# Altium schematic sheet Power.SchDoc
size A4; SheetNumber: 7; SheetTotal: 7
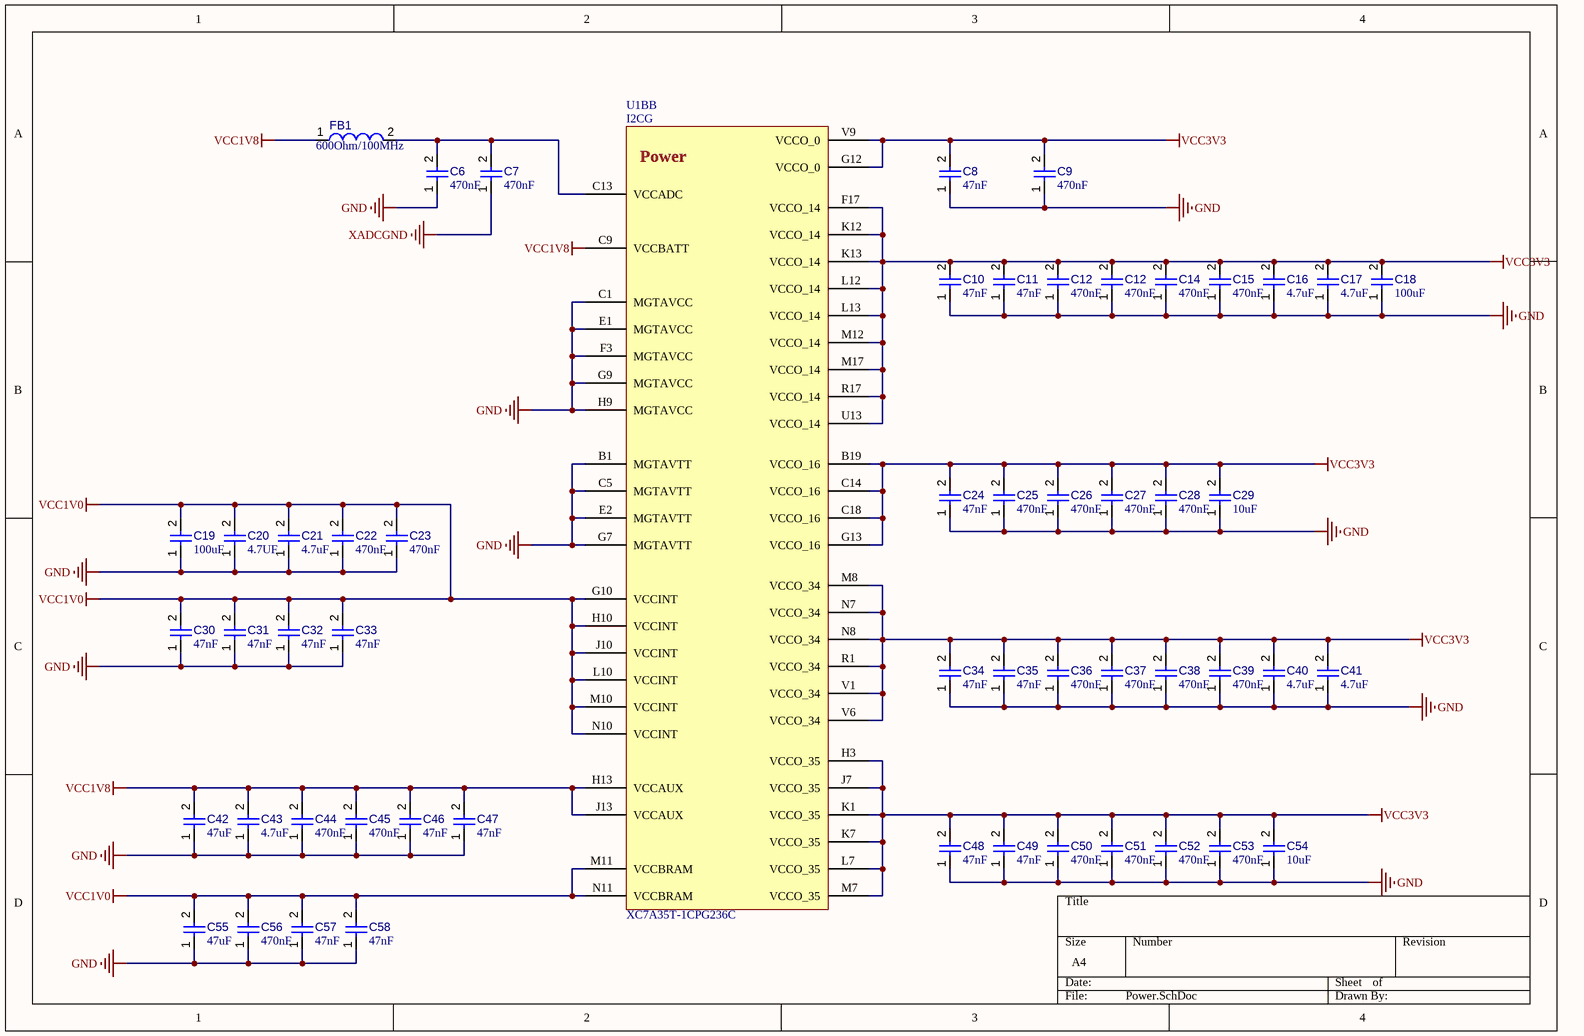
[diagram p0: Power.SchDoc]

## Parts
(Parts that share a designator on the sheet are numbered #1, #2 ... from top to bottom, then left to right.)
C6  value 470nF  [CAPC0603(1608)100_L]  (hidden comment: Capacitor 470nF +/-20% 25V 0603)
C7  value 470nF  [CAPC0603(1608)100_L]  (hidden comment: Capacitor 470nF +/-20% 25V 0603)
C8  value 47nF  [CAPC0603(1608)100_L]  (hidden comment: Capacitor 470nF +/-20% 25V 0603)
C9  value 470nF  [CAPC0603(1608)100_L]  (hidden comment: Capacitor 470nF +/-20% 25V 0603)
C10  value 47nF  [CAPC0603(1608)100_L]  (hidden comment: Capacitor 470nF +/-20% 25V 0603)
C11  value 47nF  [CAPC0603(1608)100_L]  (hidden comment: Capacitor 470nF +/-20% 25V 0603)
C12#1  value 470nF  [CAPC0603(1608)100_L]  (hidden comment: Capacitor 470nF +/-20% 25V 0603)
C12#2  value 470nF  [CAPC0603(1608)100_L]  (hidden comment: Capacitor 470nF +/-20% 25V 0603)
C14  value 470nF  [CAPC0603(1608)100_L]  (hidden comment: Capacitor 470nF +/-20% 25V 0603)
C15  value 470nF  [CAPC0603(1608)100_L]  (hidden comment: Capacitor 470nF +/-20% 25V 0603)
C16  value 4.7uF  [CAPC0603(1608)100_L]  (hidden comment: Capacitor 470nF +/-20% 25V 0603)
C17  value 4.7uF  [CAPC0603(1608)100_L]  (hidden comment: Capacitor 470nF +/-20% 25V 0603)
C18  value 100uF  [CAPC0603(1608)100_L]  (hidden comment: Capacitor 470nF +/-20% 25V 0603)
C19  value 100uF  [CAPC0603(1608)100_L]  (hidden comment: Capacitor 470nF +/-20% 25V 0603)
C20  value 4.7UF  [CAPC0603(1608)100_L]  (hidden comment: Capacitor 470nF +/-20% 25V 0603)
C21  value 4.7uF  [CAPC0603(1608)100_L]  (hidden comment: Capacitor 470nF +/-20% 25V 0603)
C22  value 470nF  [CAPC0603(1608)100_L]  (hidden comment: Capacitor 470nF +/-20% 25V 0603)
C23  value 470nF  [CAPC0603(1608)100_L]  (hidden comment: Capacitor 470nF +/-20% 25V 0603)
C24  value 47nF  [CAPC0603(1608)100_L]  (hidden comment: Capacitor 470nF +/-20% 25V 0603)
C25  value 470nF  [CAPC0603(1608)100_L]  (hidden comment: Capacitor 470nF +/-20% 25V 0603)
C26  value 470nF  [CAPC0603(1608)100_L]  (hidden comment: Capacitor 470nF +/-20% 25V 0603)
C27  value 470nF  [CAPC0603(1608)100_L]  (hidden comment: Capacitor 470nF +/-20% 25V 0603)
C28  value 470nF  [CAPC0603(1608)100_L]  (hidden comment: Capacitor 470nF +/-20% 25V 0603)
C29  value 10uF  [CAPC0603(1608)100_L]  (hidden comment: Capacitor 470nF +/-20% 25V 0603)
C30  value 47nF  [CAPC0603(1608)100_L]  (hidden comment: Capacitor 470nF +/-20% 25V 0603)
C31  value 47nF  [CAPC0603(1608)100_L]  (hidden comment: Capacitor 470nF +/-20% 25V 0603)
C32  value 47nF  [CAPC0603(1608)100_L]  (hidden comment: Capacitor 470nF +/-20% 25V 0603)
C33  value 47nF  [CAPC0603(1608)100_L]  (hidden comment: Capacitor 470nF +/-20% 25V 0603)
C34  value 47nF  [CAPC0603(1608)100_L]  (hidden comment: Capacitor 470nF +/-20% 25V 0603)
C35  value 47nF  [CAPC0603(1608)100_L]  (hidden comment: Capacitor 470nF +/-20% 25V 0603)
C36  value 470nF  [CAPC0603(1608)100_L]  (hidden comment: Capacitor 470nF +/-20% 25V 0603)
C37  value 470nF  [CAPC0603(1608)100_L]  (hidden comment: Capacitor 470nF +/-20% 25V 0603)
C38  value 470nF  [CAPC0603(1608)100_L]  (hidden comment: Capacitor 470nF +/-20% 25V 0603)
C39  value 470nF  [CAPC0603(1608)100_L]  (hidden comment: Capacitor 470nF +/-20% 25V 0603)
C40  value 4.7uF  [CAPC0603(1608)100_L]  (hidden comment: Capacitor 470nF +/-20% 25V 0603)
C41  value 4.7uF  [CAPC0603(1608)100_L]  (hidden comment: Capacitor 470nF +/-20% 25V 0603)
C42  value 47uF  [CAPC0603(1608)100_L]  (hidden comment: Capacitor 470nF +/-20% 25V 0603)
C43  value 4.7uF  [CAPC0603(1608)100_L]  (hidden comment: Capacitor 470nF +/-20% 25V 0603)
C44  value 470nF  [CAPC0603(1608)100_L]  (hidden comment: Capacitor 470nF +/-20% 25V 0603)
C45  value 470nF  [CAPC0603(1608)100_L]  (hidden comment: Capacitor 470nF +/-20% 25V 0603)
C46  value 47nF  [CAPC0603(1608)100_L]  (hidden comment: Capacitor 470nF +/-20% 25V 0603)
C47  value 47nF  [CAPC0603(1608)100_L]  (hidden comment: Capacitor 470nF +/-20% 25V 0603)
C48  value 47nF  [CAPC0603(1608)100_L]  (hidden comment: Capacitor 470nF +/-20% 25V 0603)
C49  value 47nF  [CAPC0603(1608)100_L]  (hidden comment: Capacitor 470nF +/-20% 25V 0603)
C50  value 470nF  [CAPC0603(1608)100_L]  (hidden comment: Capacitor 470nF +/-20% 25V 0603)
C51  value 470nF  [CAPC0603(1608)100_L]  (hidden comment: Capacitor 470nF +/-20% 25V 0603)
C52  value 470nF  [CAPC0603(1608)100_L]  (hidden comment: Capacitor 470nF +/-20% 25V 0603)
C53  value 470nF  [CAPC0603(1608)100_L]  (hidden comment: Capacitor 470nF +/-20% 25V 0603)
C54  value 10uF  [CAPC0603(1608)100_L]  (hidden comment: Capacitor 470nF +/-20% 25V 0603)
C55  value 47uF  [CAPC0603(1608)100_L]  (hidden comment: Capacitor 470nF +/-20% 25V 0603)
C56  value 470nF  [CAPC0603(1608)100_L]  (hidden comment: Capacitor 470nF +/-20% 25V 0603)
C57  value 47nF  [CAPC0603(1608)100_L]  (hidden comment: Capacitor 470nF +/-20% 25V 0603)
C58  value 47nF  [CAPC0603(1608)100_L]  (hidden comment: Capacitor 470nF +/-20% 25V 0603)
FB1  value 600Ohm/100MHz  [TDK-VLCF5028-2_V]  (hidden comment: VLCF5028T-2R7N1R8-2)
U1B  XC7A35T-1CPG236C  [BGA81C50P19X19_1000X1000X110]  (part B of 4)

## Nets
GND: C6.1 C8.1 C9.1 C10.1 C11.1 C12#1.1 C12#2.1 C14.1 C15.1 C16.1 C17.1 C18.1 C19.1 C20.1 C21.1 C22.1 C23.1 C24.1 C25.1 C26.1 C27.1 C28.1 C29.1 C30.1 C31.1 C32.1 C33.1 C34.1 C35.1 C36.1 C37.1 C38.1 C39.1 C40.1 C41.1 C42.1 C43.1 C44.1 C45.1 C46.1 C47.1 C48.1 C49.1 C50.1 C51.1 C52.1 C53.1 C54.1 C55.1 C56.1 C57.1 C58.1 U1B.B1(MGTAVTT) U1B.C1(MGTAVCC) U1B.C5(MGTAVTT) U1B.E1(MGTAVCC) U1B.E2(MGTAVTT) U1B.F3(MGTAVCC) U1B.G7(MGTAVTT) U1B.G9(MGTAVCC) U1B.H9(MGTAVCC)
VCC1V0: C19.2 C20.2 C21.2 C22.2 C23.2 C30.2 C31.2 C32.2 C33.2 C55.2 C56.2 C57.2 C58.2 U1B.G10(VCCINT) U1B.H10(VCCINT) U1B.J10(VCCINT) U1B.L10(VCCINT) U1B.M10(VCCINT) U1B.M11(VCCBRAM) U1B.N10(VCCINT) U1B.N11(VCCBRAM)
VCC1V8: C42.2 C43.2 C44.2 C45.2 C46.2 C47.2 FB1.1 U1B.C9(VCCBATT) U1B.H13(VCCAUX) U1B.J13(VCCAUX)
VCC3V3: C8.2 C9.2 C10.2 C11.2 C12#1.2 C12#2.2 C14.2 C15.2 C16.2 C17.2 C18.2 C24.2 C25.2 C26.2 C27.2 C28.2 C29.2 C34.2 C35.2 C36.2 C37.2 C38.2 C39.2 C40.2 C41.2 C48.2 C49.2 C50.2 C51.2 C52.2 C53.2 C54.2 U1B.B19(VCCO_16) U1B.C14(VCCO_16) U1B.C18(VCCO_16) U1B.F17(VCCO_14) U1B.G12(VCCO_0) U1B.G13(VCCO_16) U1B.H3(VCCO_35) U1B.J7(VCCO_35) U1B.K1(VCCO_35) U1B.K7(VCCO_35) U1B.K12(VCCO_14) U1B.K13(VCCO_14) U1B.L7(VCCO_35) U1B.L12(VCCO_14) U1B.L13(VCCO_14) U1B.M7(VCCO_35) U1B.M8(VCCO_34) U1B.M12(VCCO_14) U1B.M17(VCCO_14) U1B.N7(VCCO_34) U1B.N8(VCCO_34) U1B.R1(VCCO_34) U1B.R17(VCCO_14) U1B.U13(VCCO_14) U1B.V1(VCCO_34) U1B.V6(VCCO_34) U1B.V9(VCCO_0)
XADCGND: C7.1
NetC6_2: C6.2 C7.2 FB1.2 U1B.C13(VCCADC)

## Notes on the sheet
- (in symbol CMP-020-00032-3, part B) I2CG; Power

## Library data of the parts
C6-C11 C12#1 C12#2 C14-C58 = CMP-001-00077-3: Chip Capacitor, 470nF +/-20%, 25V, 0603, Thickness 1 mm; Tolerance: 10%; Max Operating Temperature: 85°C; Voltage Rating: 25V; Pins: 2; Case/Package: 0603; Mounting Technology: SMT; Min Operating Temperature: -55°C
FB1 = CMP-006-00017-6: Inductor for Power Circuits, 2.7 uH, +/- 30%,100 KHz, 1.82 A, -40 to 105 degC, 2-Pin SMD, RoHS, Reel; Manufacturer: TDK; Resistance: 0.033Ohm; Shielding: Shielded; Core Material: Ferrite; Current Rating: 1.82A; Tolerance: 30%; Package Quantity: 500; Datasheet Version: Apr-16; Max Operating Temperature: 105°C; RoHS Compliant: True; Min Operating Temperature: -40°C; Datasheet URL: https://product.tdk.com/info/en/catalog/datasheets/inductor_commercial_power_vlcf5028-2_en.pdf; Packaging: TapeandReel; Package Description: 2-Pin Surface Mount Device, Body 5.2 x 5.3 mm; Mounting Technology: SM; Saturation Current: 1.82A; Inductance Tolerance: 30%; Package Reference: VLCF5028-2; Case/Package: 5028
U1B = CMP-020-00032-3: FPGA Artix-7 Family 33280 Cells 28nm Technology 1V 236-Pin CSBGA; Max Supply Voltage: 1.05V; Min Supply Voltage: 950mV; RAM Size: 225kB; Clock Frequency: 1.098GHz; Min Operating Temperature: 0°C; Case/Package: LFBGA; Pins: 236; Max Operating Temperature: 85°C